# EAGLE design TempX (EAGLE 7.2.0)
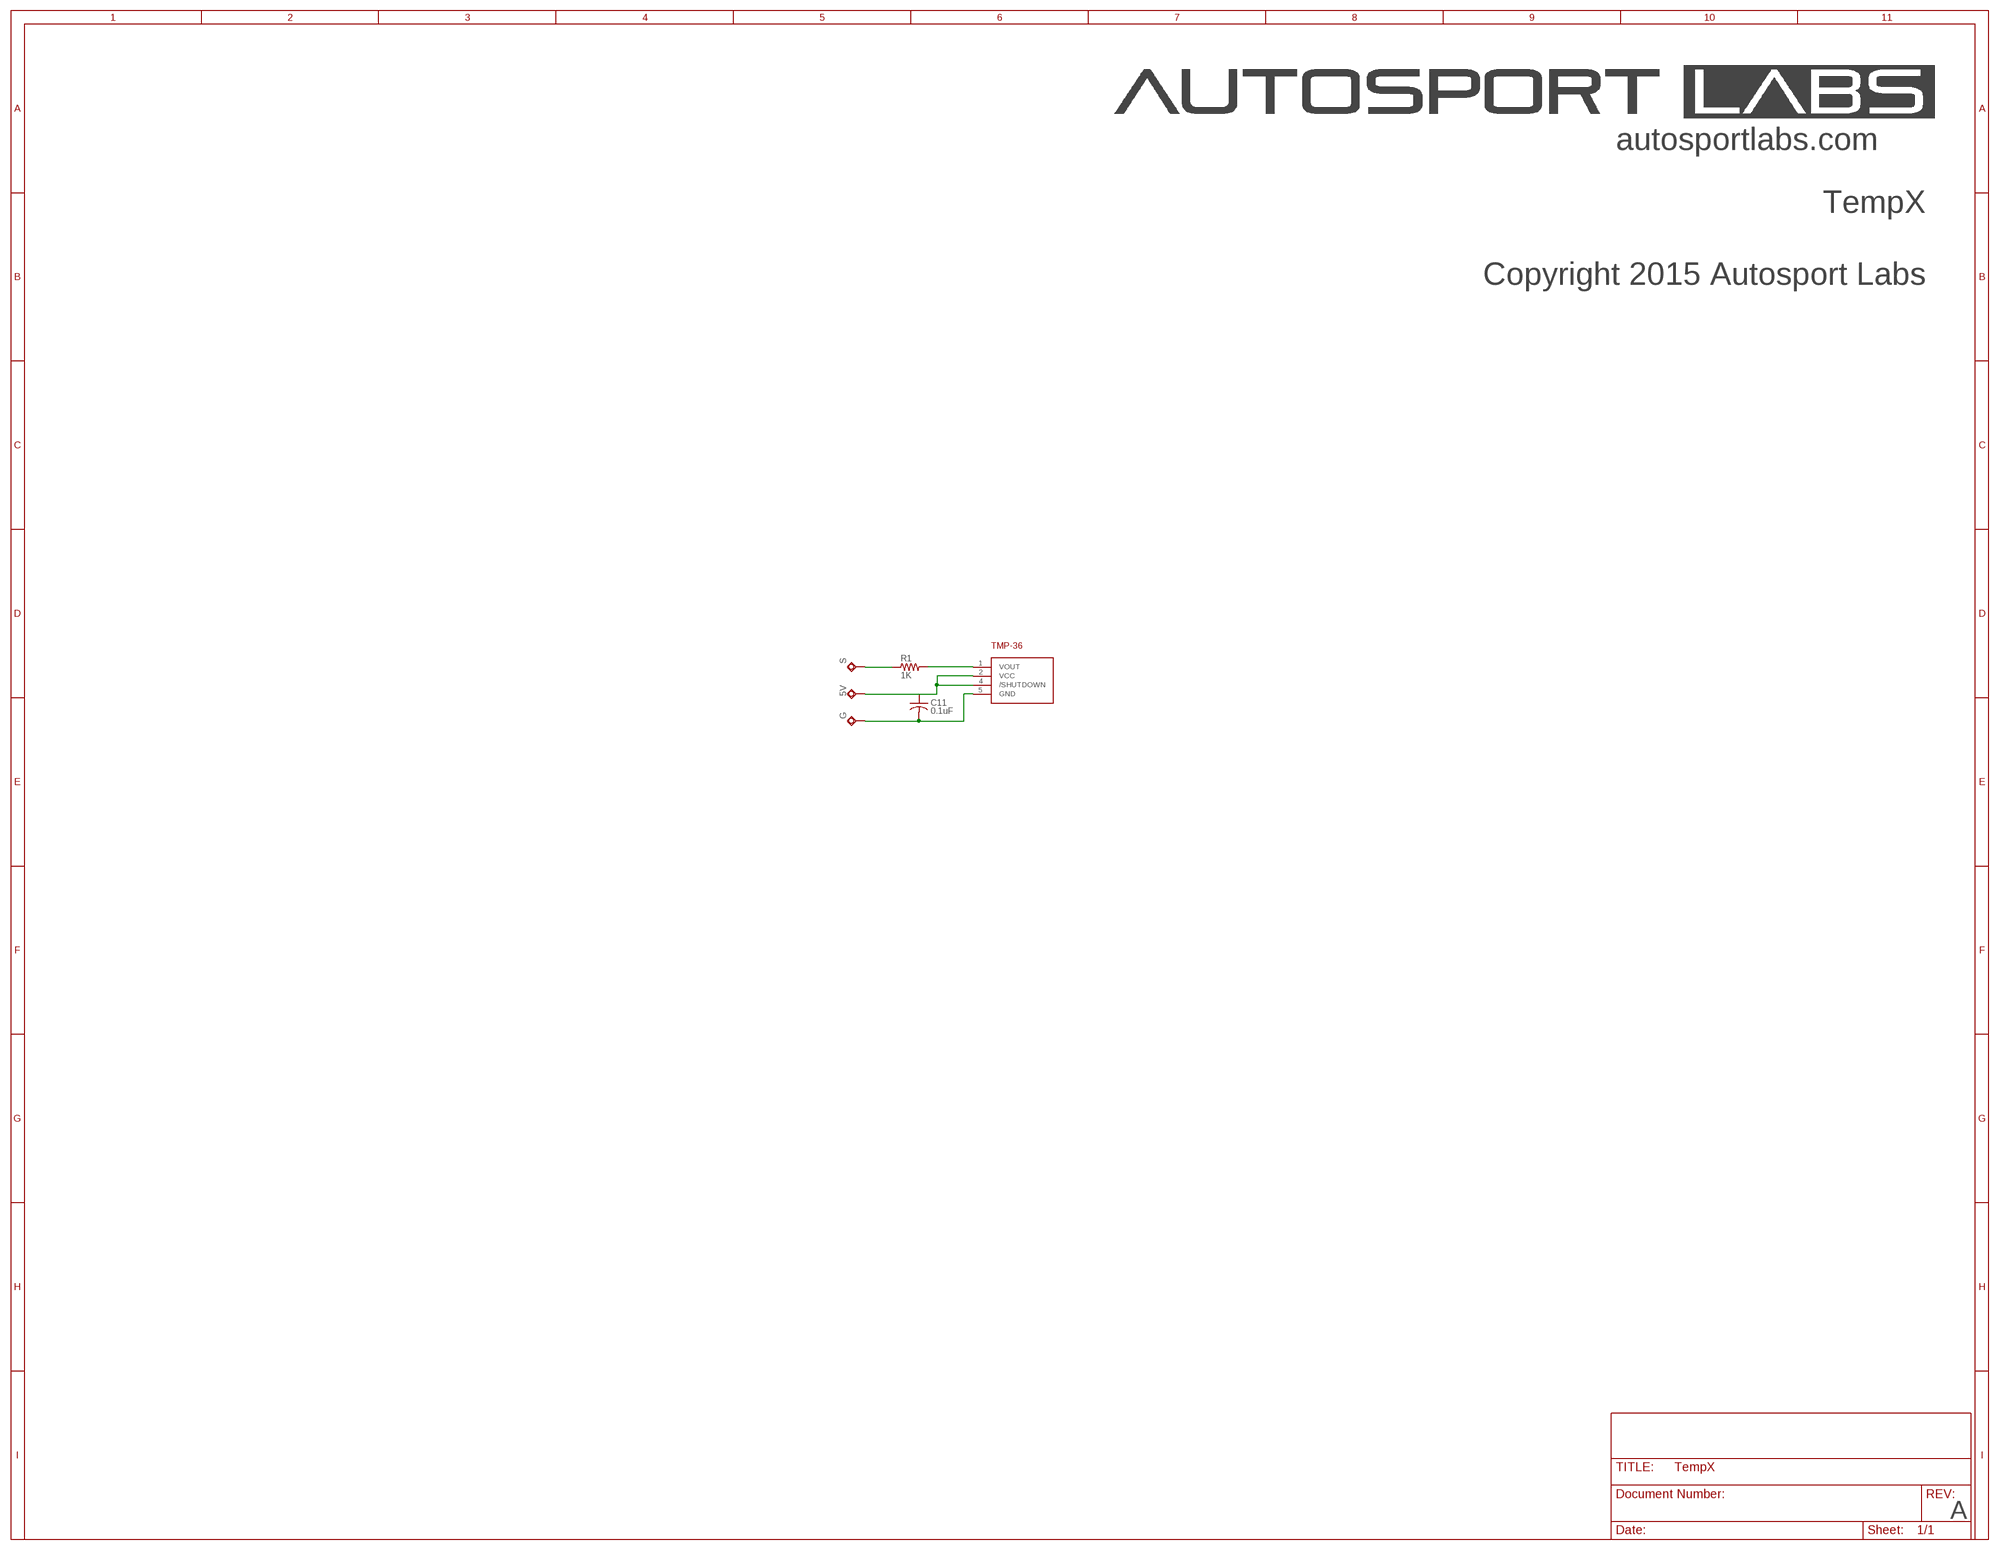
[diagram p0: schematic, sheet 1]

## Parts
5V  TPSQPAD1-17  [P1-17]
C11  0.1uF  C-USC0603  [C0603]
G  TPSQPAD1-17  [P1-17]
R1  1K  R-US_R0603  [R0603]
S  TPSQPAD1-17  [P1-17]
U1  TMP36  [SOT-23]

## Nets
5V: 5V.TP C11.1 U1.2(VCC) U1.4(/SHUTDOWN)
C1: C11.2 G.TP U1.5(GND)
N$1: R1.1 S.TP
N$2: R1.2 U1.1(VOUT)

## Notes on the sheet
- autosportlabs.com
- TempX
- Copyright 2015 Autosport Labs
- A

## Library data of the parts
5V G S = testpad:TPSQ: Test pad
C11 = rcl:C-US: CAPACITOR, American symbol
R1 = rcl:R-US_: RESISTOR, American symbol
U1 = TMP36:TMP36

## Board
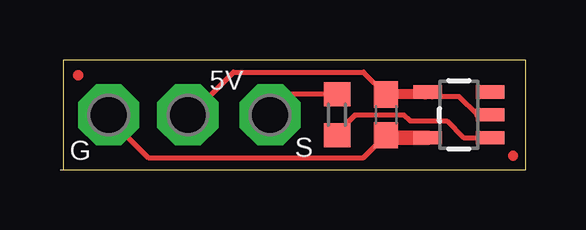
[diagram p1: board, top side]
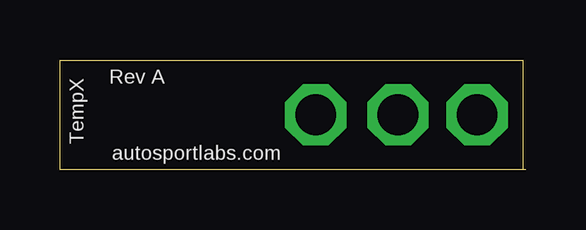
[diagram p2: board, bottom side, seen from below]

Size 19.43 x 4.57 mm. Coordinates in mm from the lower left corner, seen from the top.
Outline: 0,0 0.13,0
Outline: 0.13,0 19.43,0 19.43,4.57 0.13,4.57 0.13,0
Copper layers (1*16): Top 0.035mm / dielectric 1.5mm / Bottom 0.035mm
Design rules "default *": minimum track width 10mil, minimum drill 24mil, track to track 8mil, track to pad 8mil, pad to pad 8mil, via to via 8mil, smd to smd 8mil, copper to edge 40mil, drill to drill 8mil, minimum pad ring 10mil, minimum via ring 8mil, stop-mask expansion 4mil, vias tented up to drill 16mil, thermal gap 10mil

### Footprints (pad centres in the part's own frame; a part is rotated, then mirrored left to right if it is on the bottom)
P1-17 = drill 1.702 pad 2.54 octagon: TP 0,0
C0603 = smd 1.1 x 1: 1 -0.85,0; 2 0.85,0
R0603 = smd 1 x 1.1: 1 -0.85,0; 2 0.85,0
SOT-23 = smd 0.55 x 1.2: 1 -0.95,-1.3; 2 0,-1.3; 3 0.95,-1.3; 4 0.95,1.3; 5 -0.95,1.3

### Placement (x,y rotation side)
5V  5.33,2.29 0 top
C11  13.59,2.29 270 top
G  2.03,2.29 0 top
R1  11.56,2.29 270 top
S  8.76,2.29 0 top
U1  16.64,2.29 90 top

### Tracks (layer width: path | path; a pad name or v marks a point on that pad's centre or on a via)
5V
  Top 0.203: 15.53,3.05 16.64,3.05 17.4,2.29 | 5.46,2.29 7.24,4.06 12.66,4.06 C11.1
  Top 0.254: 15.27,3.3 U1.4 15.53,3.05 | U1.2 17.4,2.29 | 5V.TP 5.46,2.29
  Top 0.305: U1.4 15.24,3.14
  Top 0.406: 15.24,3.14 C11.1
C1
  Top 0.203: 2.03,2.16 3.68,0.51 12.66,0.51 C11.2
  Top 0.254: 13.69,1.34 C11.2 | G.TP 2.03,2.16
  Top 0.61: U1.5 13.69,1.34
N$1
  Top 0.203: R1.1 9.61,3.14 S.TP
N$2
  Top 0.203: 11.56,1.52 12.32,2.29 14.35,2.29 14.61,2.03 16.13,2.03 16.82,1.34 U1.1
  Top 0.254: 11.56,1.52 R1.2
(copper drawn outside any net)
  shapes: Top circle x2

### Text on the board
bPlace: Rev A | TempX | autosportlabs.com